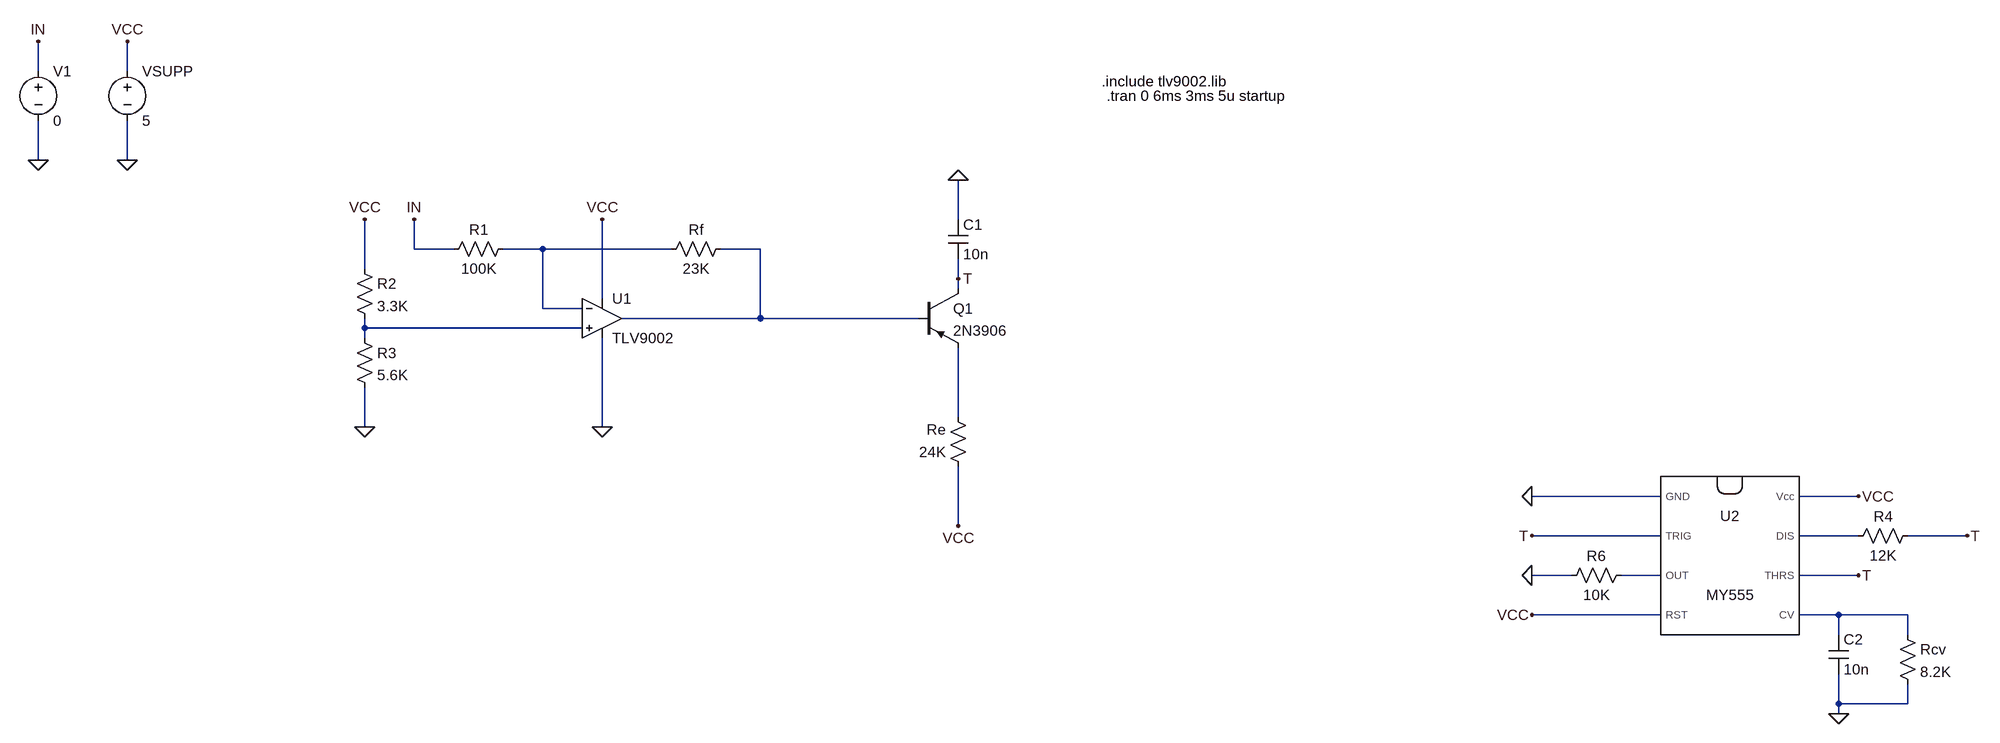
[diagram p0: schematic tx.asc]
tx.asc, the LTspice schematic file:
Version 4.1
SHEET 1 2272 932
WIRE -880 -128 -880 -176
WIRE -736 -128 -736 -176
WIRE -880 16 -880 -48
WIRE -736 16 -736 -48
WIRE 608 112 608 48
WIRE -272 160 -272 112
WIRE -208 160 -272 160
WIRE -64 160 -128 160
WIRE 144 160 -64 160
WIRE 288 160 224 160
WIRE -352 192 -352 112
WIRE 608 208 608 176
WIRE 608 224 608 208
WIRE 32 240 32 112
WIRE -64 256 -64 160
WIRE 0 256 -64 256
WIRE 288 272 64 272
WIRE 288 272 288 160
WIRE 544 272 288 272
WIRE -352 288 -352 272
WIRE 0 288 -352 288
WIRE -352 304 -352 288
WIRE 608 432 608 320
WIRE -352 448 -352 384
WIRE 32 448 32 304
WIRE 1744 560 1536 560
WIRE 2064 560 1968 560
WIRE 608 608 608 512
WIRE 1744 624 1536 624
WIRE 2064 624 1968 624
WIRE 2240 624 2144 624
WIRE 1600 688 1536 688
WIRE 1744 688 1680 688
WIRE 2064 688 1968 688
WIRE 1744 752 1536 752
WIRE 2032 752 1968 752
WIRE 2144 752 2032 752
WIRE 2032 784 2032 752
WIRE 2144 784 2144 752
WIRE 2032 896 2032 848
WIRE 2144 896 2144 864
WIRE 2144 896 2032 896
WIRE 2032 912 2032 896
FLAG -880 -176 IN
FLAG -880 16 0
FLAG -272 112 IN
FLAG -736 -176 VCC
FLAG -736 16 0
FLAG -352 112 VCC
FLAG -352 448 0
FLAG 32 112 VCC
FLAG 32 448 0
FLAG 608 48 0
FLAG 2032 912 0
FLAG 1536 688 0
FLAG 608 208 T
FLAG 2064 560 VCC
FLAG 1536 560 0
FLAG 1536 752 VCC
FLAG 2240 624 T
FLAG 2064 688 T
FLAG 1536 624 T
FLAG 608 608 VCC
SYMBOL OpAmps\\TLV9002 32 208 R0
SYMATTR InstName U1
SYMATTR SpiceModel ""
SYMBOL voltage -880 -144 R0
WINDOW 123 0 0 Left 0
WINDOW 39 0 0 Left 0
SYMATTR InstName V1
SYMATTR Value 0
SYMBOL res -112 144 R90
WINDOW 0 0 56 VBottom 2
WINDOW 3 32 56 VTop 2
SYMATTR InstName R1
SYMATTR Value 100K
SYMBOL res 240 144 R90
WINDOW 0 0 56 VBottom 2
WINDOW 3 32 56 VTop 2
SYMATTR InstName Rf
SYMATTR Value 23K
SYMBOL res -368 176 R0
SYMATTR InstName R2
SYMATTR Value 3.3K
SYMBOL res -368 288 R0
SYMATTR InstName R3
SYMATTR Value 5.6K
SYMBOL voltage -736 -144 R0
WINDOW 123 0 0 Left 0
WINDOW 39 0 0 Left 0
SYMATTR InstName VSUPP
SYMATTR Value 5
SYMBOL pnp 544 224 R0
SYMATTR InstName Q1
SYMATTR Value 2N3906
SYMBOL res 624 528 R180
WINDOW 0 36 76 Left 2
WINDOW 3 36 40 Left 2
SYMATTR InstName Re
SYMATTR Value 24K
SYMBOL cap 592 112 R0
SYMATTR InstName C1
SYMATTR Value 10n
SYMBOL cap 2016 784 R0
SYMATTR InstName C2
SYMATTR Value 10n
SYMBOL res 1696 672 R90
WINDOW 0 0 56 VBottom 2
WINDOW 3 32 56 VTop 2
SYMATTR InstName R6
SYMATTR Value 10K
SYMBOL res 2128 768 R0
SYMATTR InstName Rcv
SYMATTR Value 8.2K
SYMBOL Misc\\mysymbol 1856 656 R0
SYMATTR InstName U2
SYMBOL res 2160 608 R90
WINDOW 0 0 56 VBottom 2
WINDOW 3 32 56 VTop 2
SYMATTR InstName R4
SYMATTR Value 12K
TEXT 840 -112 Left 2 !.include tlv9002.lib
TEXT 848 -88 Left 2 !.tran 0 6ms 3ms 5u startup

The netlist it stands for:
* tx.asc
X§U1 N003 N001 VCC 0 N002 TLV9002  ; pins In+ In- V+ V- OUT
V1 IN 0 0
R1 N001 IN 100K
Rf N002 N001 23K
R2 VCC N003 3.3K
R3 N003 0 5.6K
VSUPP VCC 0 5
Q1 T N002 N004 0 2N3906
Re VCC N004 24K
C1 0 T 10n
C2 N007 0 10n
R6 N006 0 10K
Rcv N007 0 8.2K
X§U2 0 T N006 VCC N007 T N005 VCC MY555  ; pins GND TRIG OUT RST CV THRS DIS Vcc
R4 T N005 12K
.model NPN NPN
.model PNP PNP
.lib standard.bjt
.include tlv9002.lib
.tran 0 6ms 3ms 5u startup
.lib MY555.sub
.backanno
.end